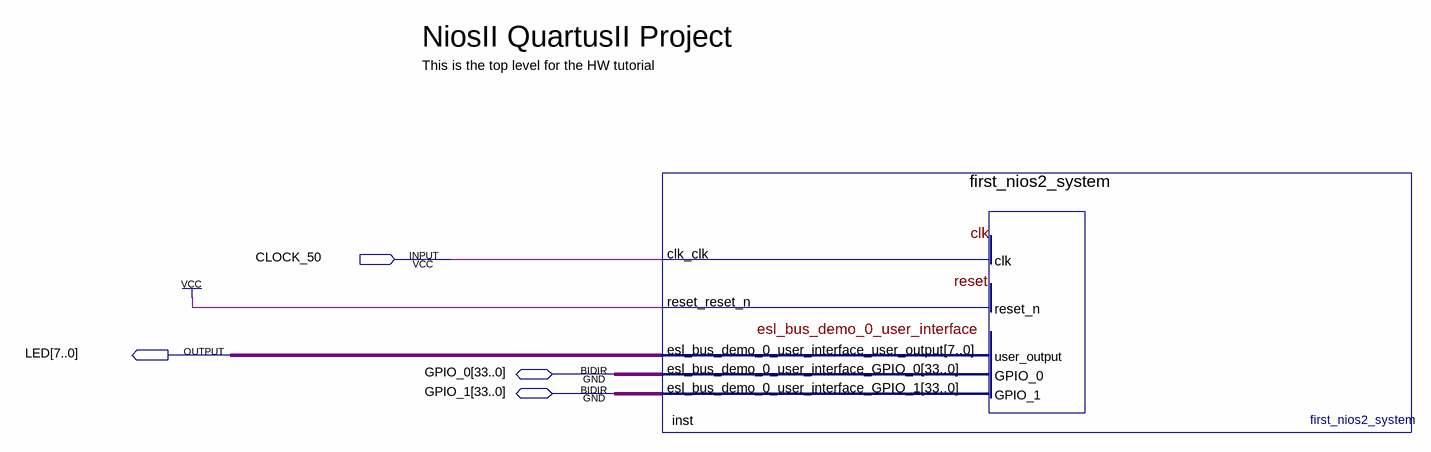
[diagram p0: schematic sheet]
// Quartus schematic nios2_quartus2_project.bdf as structural Verilog: 1 symbols, 4 pins
module nios2_quartus2_project (
  input  CLOCK_50,
  inout  [33:0] GPIO_0,
  inout  [33:0] GPIO_1,
  output [7:0] LED
);

  first_nios2_system inst (
    .clk_clk(CLOCK_50), .reset_reset_n(1'b1), .esl_bus_demo_0_user_interface_user_output(LED),
    .esl_bus_demo_0_user_interface_GPIO_0(GPIO_0), .esl_bus_demo_0_user_interface_GPIO_1(GPIO_1));

  // Notes on the sheet:
  //   NiosII QuartusII Project
  //   This is the top level for the HW tutorial
endmodule
